# EasyEDA schematic SCH_sir-kodic_2026-05-30.json
TITLE: Sheet_1; REV: 1.0; Date: 2026-05-20; Sheet: 1/1; Company: Your Company
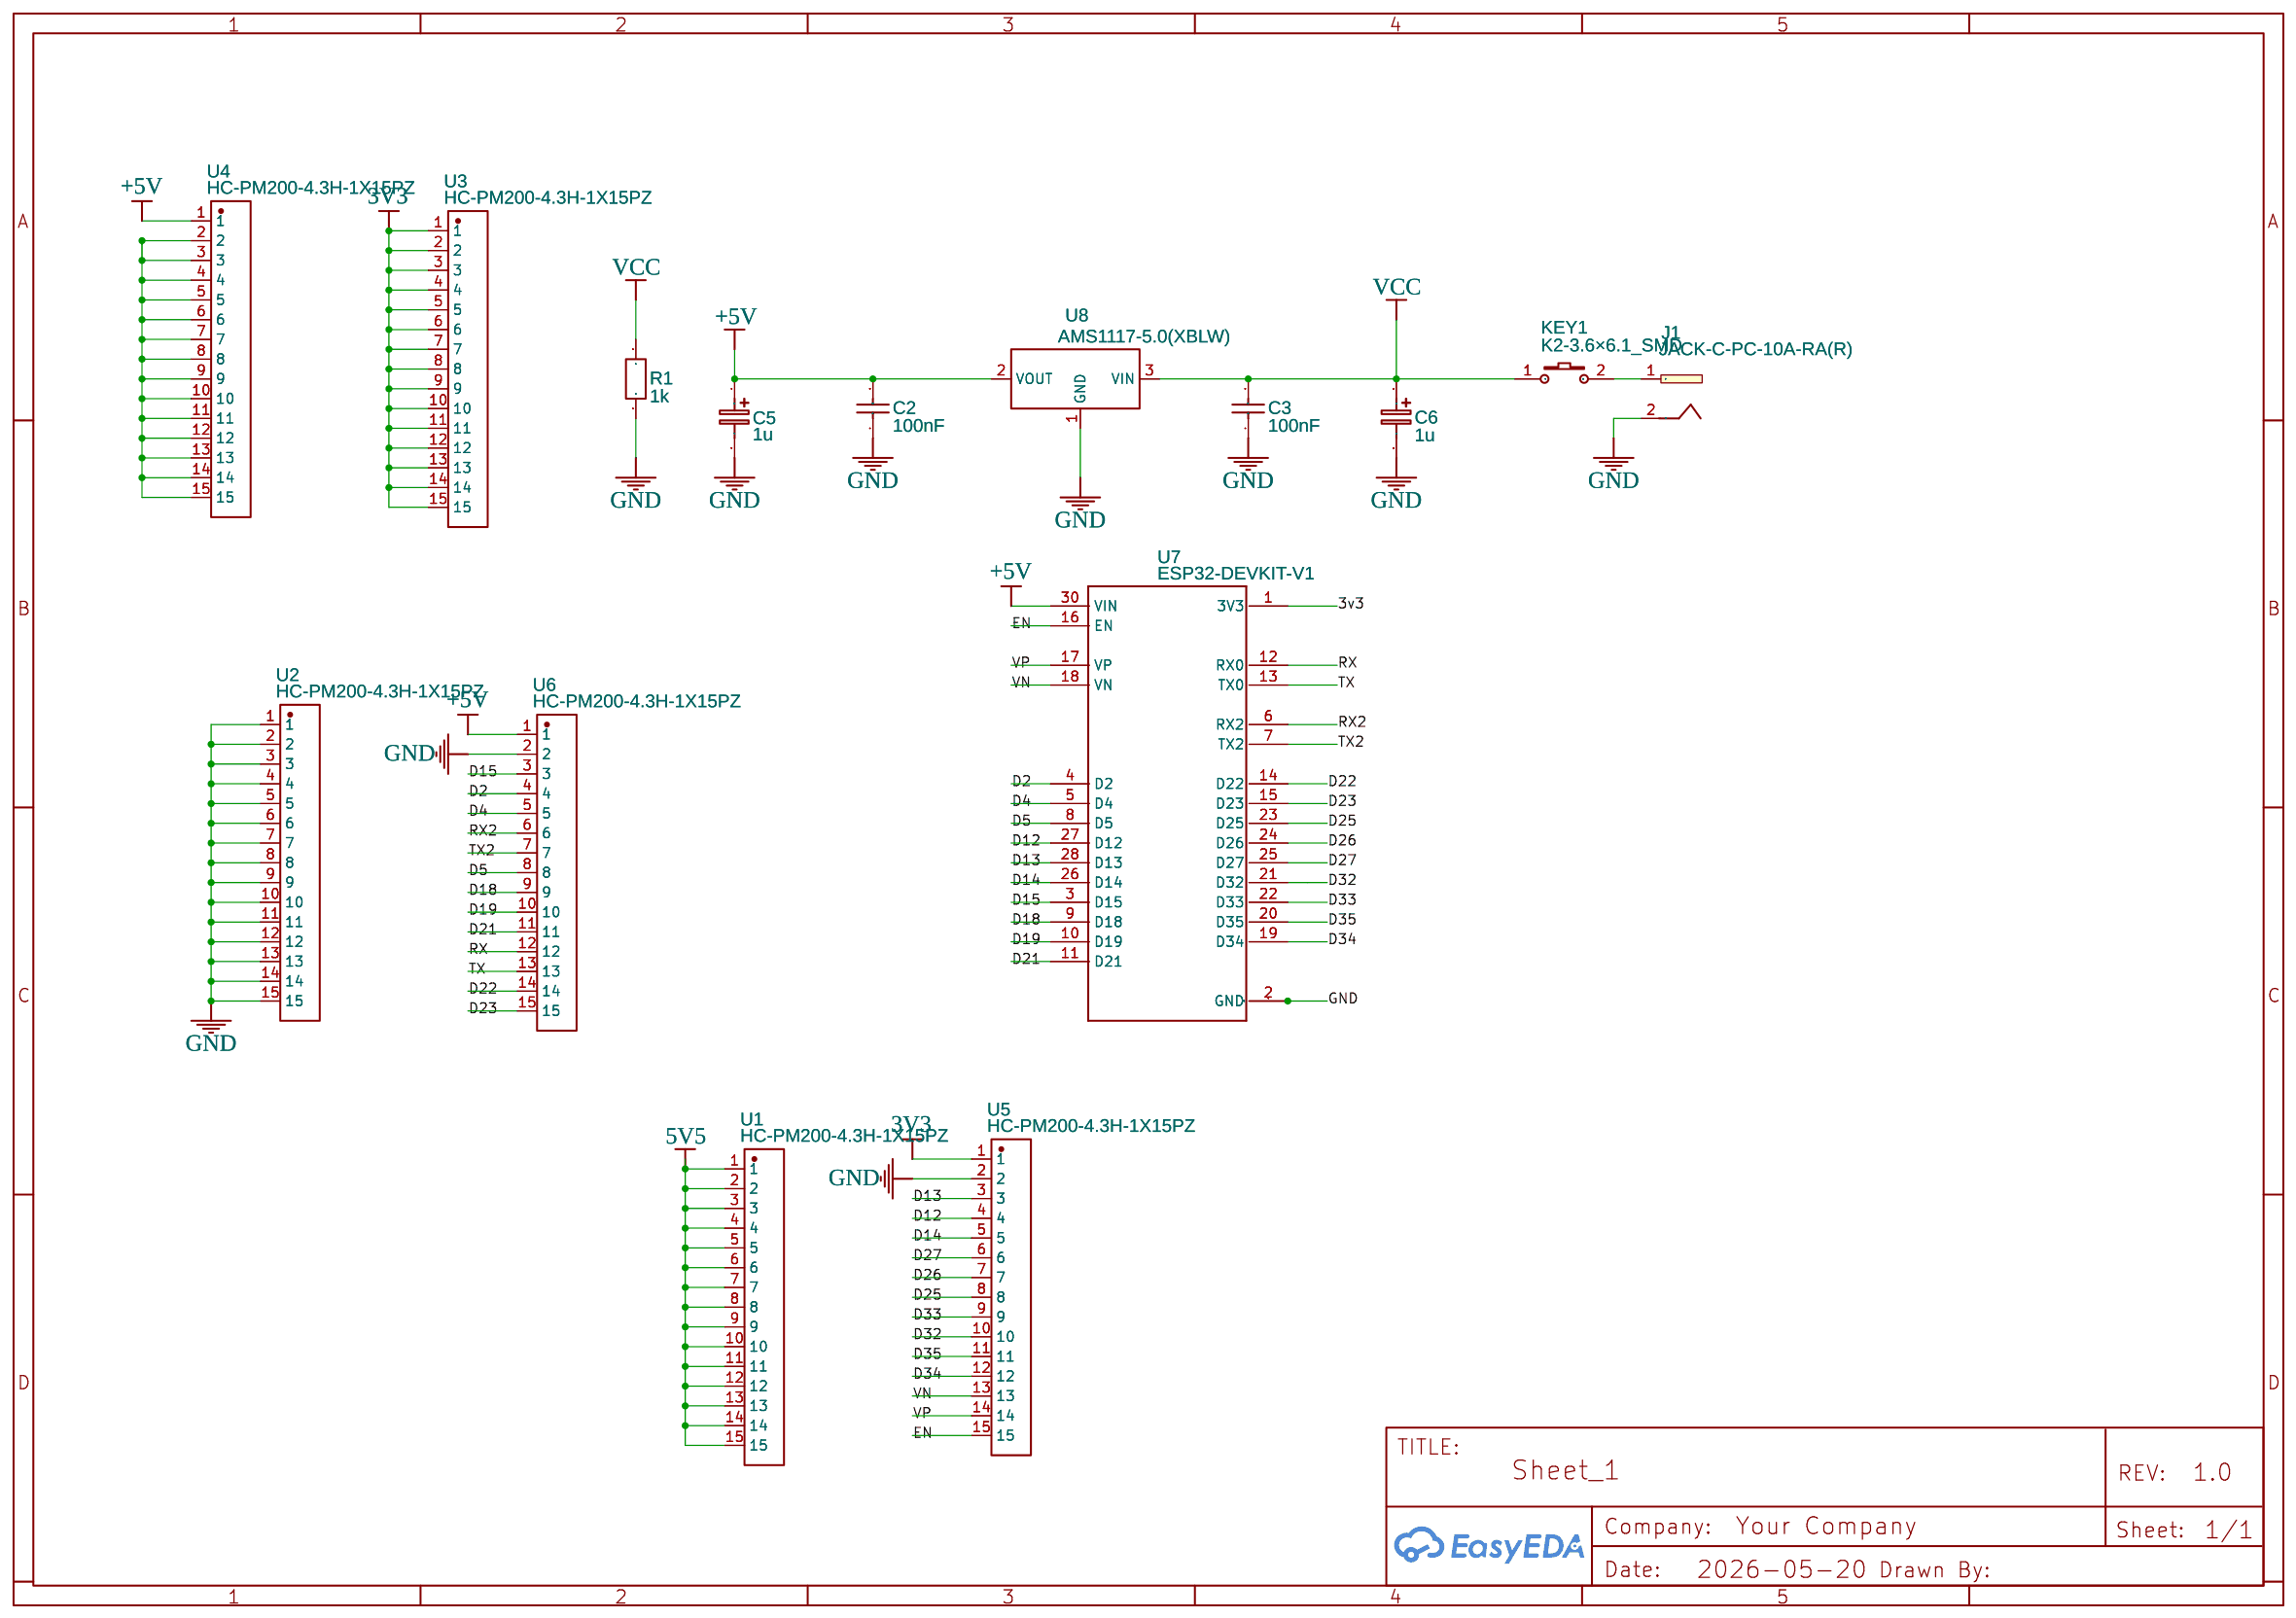
[diagram p0: schematic sheet]

## Parts
C2  100nF  [CAP-TH_L4.9-W3.7-P5.08-D0.5]
C3  100nF  [CAP-TH_L4.9-W3.7-P5.08-D0.5]
C5  1u  [CASE-A_3216]
C6  1u  [CASE-A_3216]
J1  JACK-C-PC-10A-RA(R)  [GLOBTECK_JACK-C-PC-10A-RA(R)]
KEY1  K2-3.6×6.1_SMD  [KEY-SMD_2P-L6.2-W3.6-LS8.0]
R1  1k  [R0603]
U1  HC-PM200-4.3H-1X15PZ  [CONN-TH_HC-PM200-4.3H-1X15PZ]
U2  HC-PM200-4.3H-1X15PZ  [CONN-TH_HC-PM200-4.3H-1X15PZ]
U3  HC-PM200-4.3H-1X15PZ  [CONN-TH_HC-PM200-4.3H-1X15PZ]
U4  HC-PM200-4.3H-1X15PZ  [CONN-TH_HC-PM200-4.3H-1X15PZ]
U5  HC-PM200-4.3H-1X15PZ  [CONN-TH_HC-PM200-4.3H-1X15PZ]
U6  HC-PM200-4.3H-1X15PZ  [CONN-TH_HC-PM200-4.3H-1X15PZ]
U7  ESP32-DEVKIT-V1  [MODULE_ESP32_DEVKIT_V1]
U8  AMS1117-5.0(XBLW)  [SOT-89-3_L4.5-W2.5-P1.50-LS4.2-BR]

## Library data of the parts
C2 C3 = 100nF: Supplier: LCSC; Manufacturer: null; Manufacturer Part: 0.1UF(104) +-20% 63v; Supplier Part: C19355; JLCPCB Part Class: Extended Part
C5 C6 = C_Tan_SMD_A_EU: Contributor: LCEDA_Lib
J1 = JACK-C-PC-10A-RA(R): Contributor: aryanborbon
KEY1 = K2-3.6×6.1_SMD: Supplier Part: C118141; Supplier: LCSC; Manufacturer Part: K2-1107ST-A4SW-06; Contributor: LCEDA_Lib; 制造商: 韩国韩荣
R1 = R_0603_EU: Contributor: LCEDA_Lib
U1-U6 = HC-PM200-4.3H-1X15PZ: Supplier: LCSC; Supplier Part: C22373850; Manufacturer: HC(虹成电子); Manufacturer Part: HC-PM200-4.3H-1x15PZ; JLCPCB Part Class: Extended Part; Contributor: lcsc
U7 = ESP32-DEVKIT-V1
U8 = AMS1117-5.0(XBLW): Supplier: LCSC; Supplier Part: C18816321; Manufacturer: XBLW(芯伯乐); Contributor: lcsc; JLCPCB Part Class: Extended Part

## Nets
3V3: U3.1 U3.2 U3.3 U3.4 U3.5 U3.6 U3.7 U3.8 U3.9 U3.10 U3.11 U3.12 U3.13 U3.14 U3.15 U5.1
3v3: U7.1(3V3)
5V5: U1.1 U1.2 U1.3 U1.4 U1.5 U1.6 U1.7 U1.8 U1.9 U1.10 U1.11 U1.12 U1.13 U1.14 U1.15
+5V: C2.2 C5.1 U4.1 U6.1 U7.30(VIN) U8.2(VOUT)
GND: C2.1 C3.1 C5.2 C6.2 J1.2 R1.1 U2.1 U2.2 U2.3 U2.4 U2.5 U2.6 U2.7 U2.8 U2.9 U2.10 U2.11 U2.12 U2.13 U2.14 U2.15 U5.2 U6.2 U7.2(GND) U7.29(GND) U8.1(GND)
VCC: C3.2 C6.1 KEY1.1 R1.2 U8.3(VIN)
D2: U6.4 U7.4(D2)
D4: U6.5 U7.5(D4)
D5: U6.8 U7.8(D5)
D12: U5.4 U7.27(D12)
D13: U5.3 U7.28(D13)
D14: U5.5 U7.26(D14)
D15: U6.3 U7.3(D15)
D18: U6.9 U7.9(D18)
D19: U6.10 U7.10(D19)
D21: U6.11 U7.11(D21)
D22: U6.14 U7.14(D22)
D23: U6.15 U7.15(D23)
D25: U5.8 U7.23(D25)
D26: U5.7 U7.24(D26)
D27: U5.6 U7.25(D27)
D32: U5.10 U7.21(D32)
D33: U5.9 U7.22(D33)
D34: U5.12 U7.19(D34)
D35: U5.11 U7.20(D35)
EN: U5.15 U7.16(EN)
RX: U6.12 U7.12(RX0)
RX2: U6.6 U7.6(RX2)
TX: U6.13 U7.13(TX0)
TX2: U6.7 U7.7(TX2)
VN: U5.13 U7.18(VN)
VP: U5.14 U7.17(VP)
Net-(J1-1): J1.1 KEY1.2
Net-(U4-2): U4.2 U4.3 U4.4 U4.5 U4.6 U4.7 U4.8 U4.9 U4.10 U4.11 U4.12 U4.13 U4.14 U4.15
